# Altium schematic sheet 105358-3SC001-01-A_PWR_MGMT.SchDoc: Power Management
size 420 x 297 mm; DrawnBy: JeSa, KaKa; Organization: Hotswap Norden AB; Address1: Knarrarnäsgatan 7; Address2: SE-164 40 Kista; Address3: Sweden; DocumentNumber: 105358-3SC001-01; SheetNumber: 3; SheetTotal: 5; PageSetup: Record=PageOptions|CenterHorizontal=True|CenterVertical=True|PrintScale=0.96|XCorrection=1.00|YCorrection=1.00|PrintKind=0|BorderSize=5000000|LeftOffset=0|BottomOffset=0|Orientation=2|PaperLength=1000|PaperWidth=1000|Scale=100|PaperSource=7|PrintQuality=-4|MediaType=1|DitherType=10|PaperKind=A3|PrintScaleMode=1
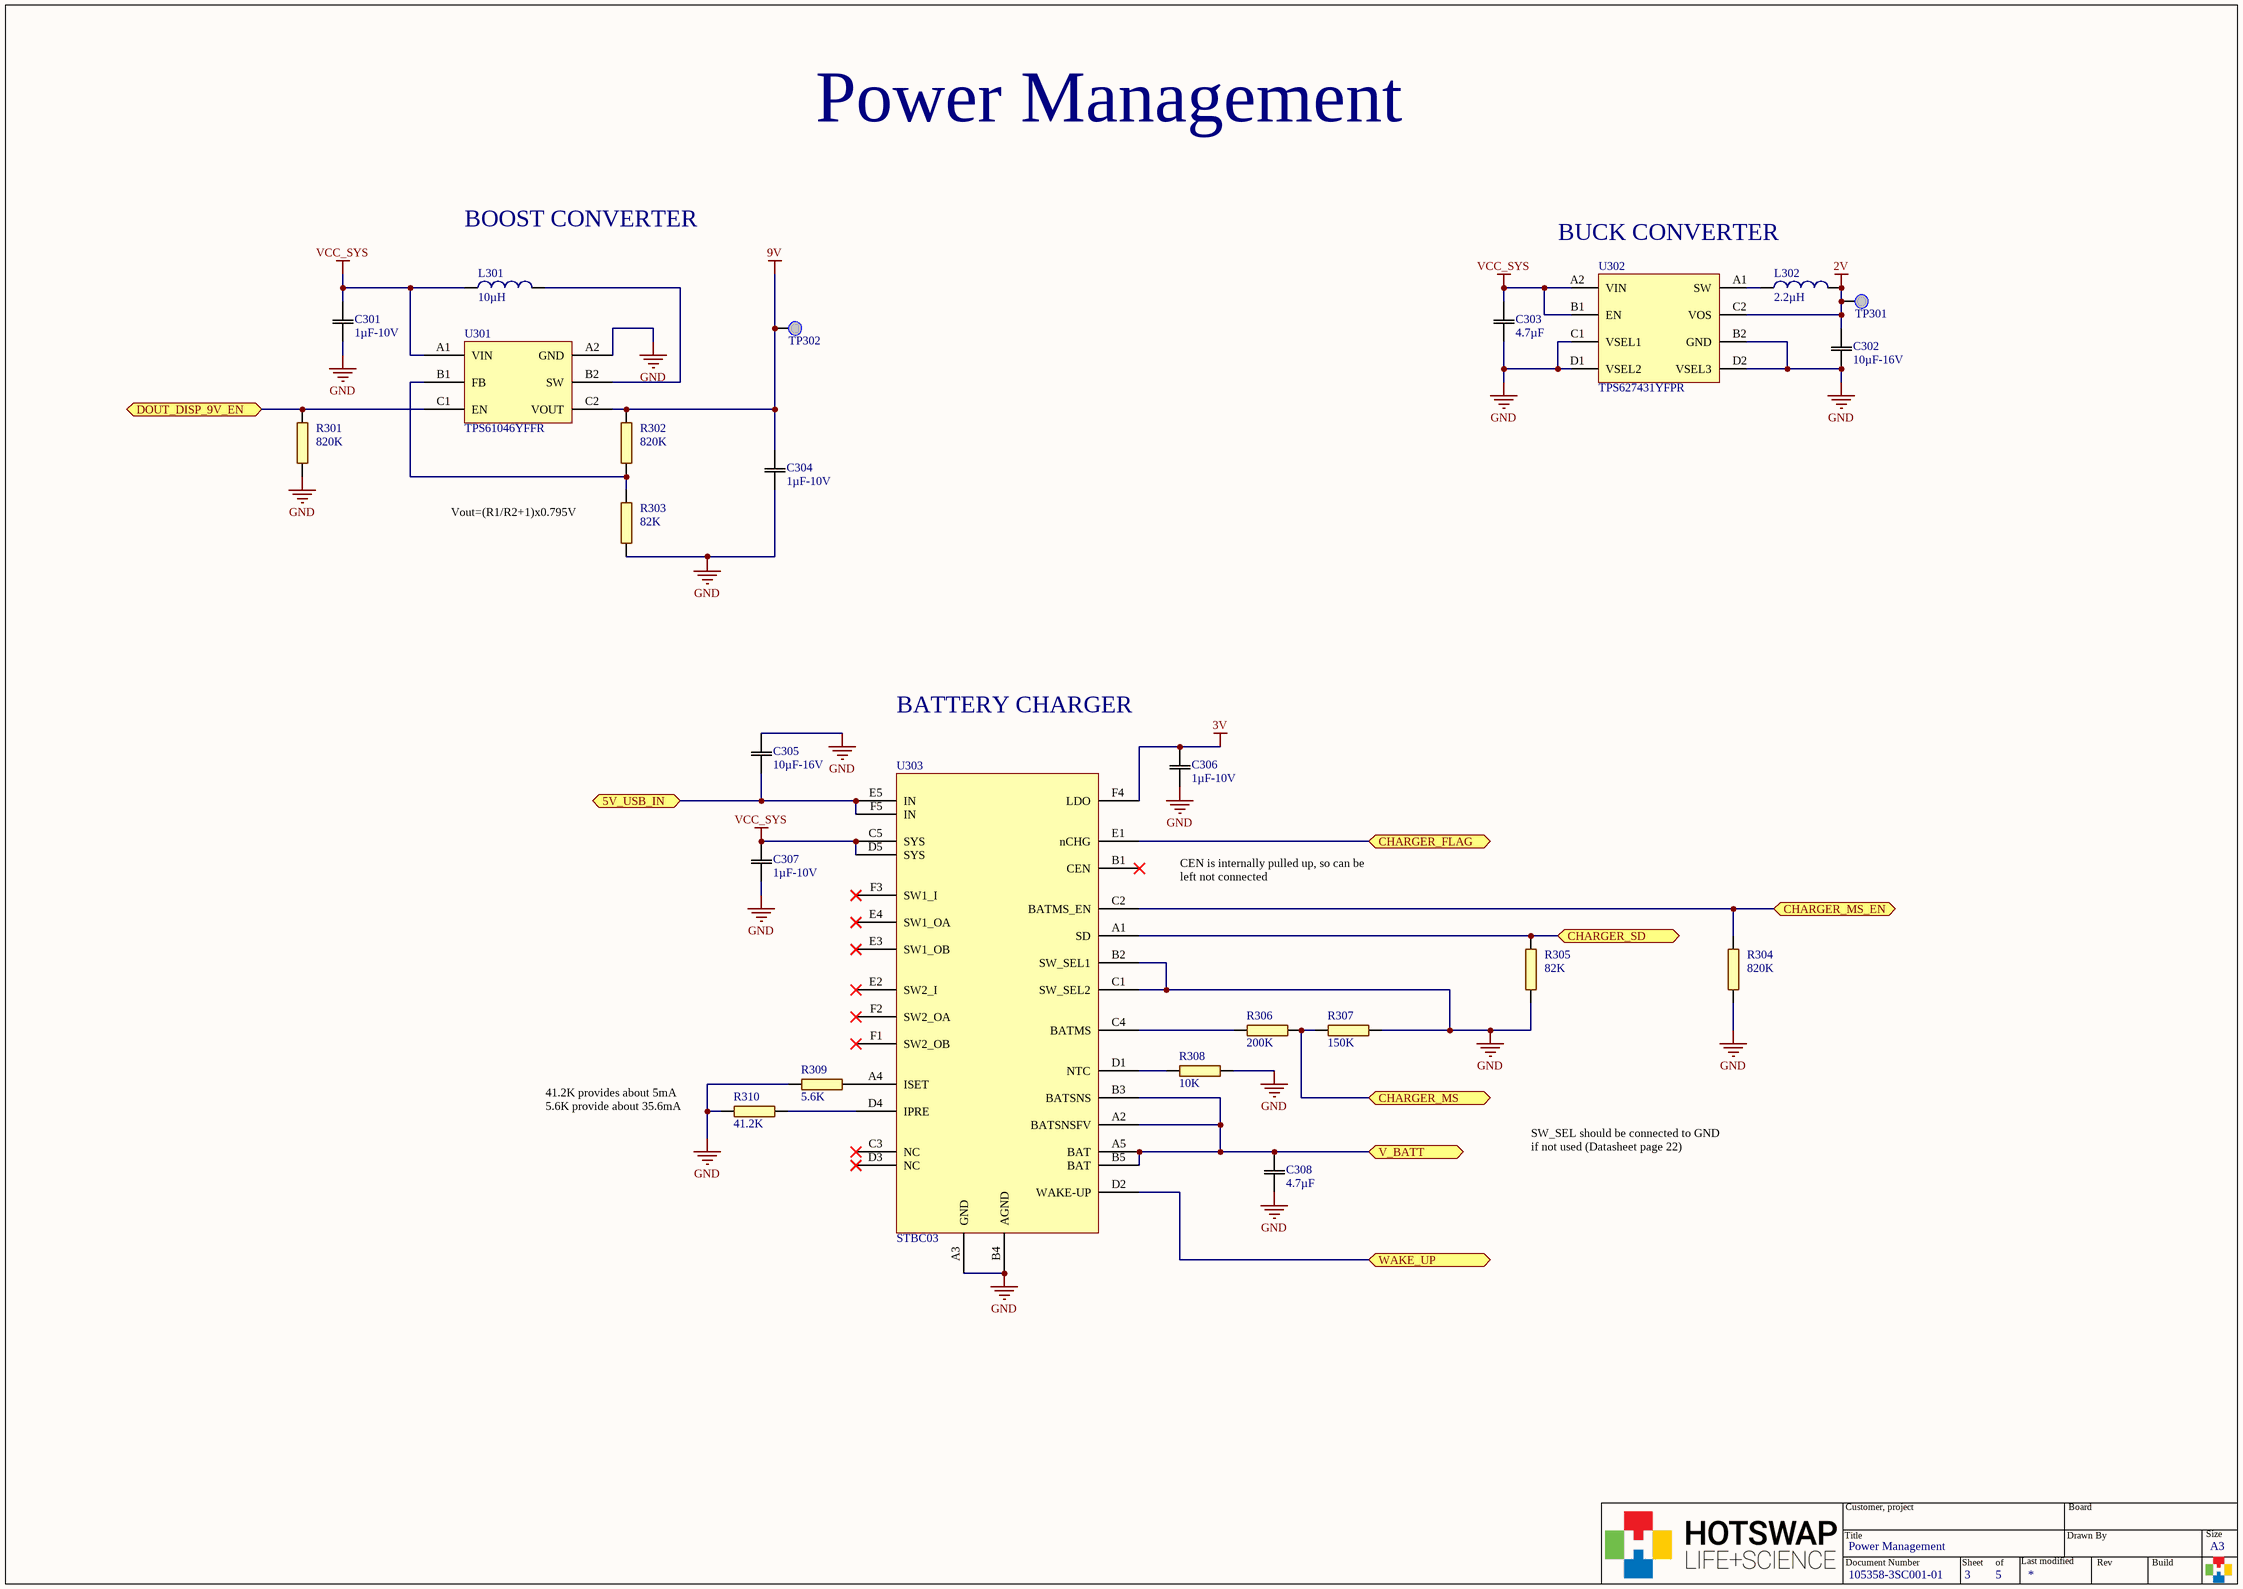
[diagram p0: 105358-3SC001-01-A_PWR_MGMT.SchDoc]

## Parts
C301  1µF-10V  [0402C_HIGH_DENSITY]
C302  10µF-16V  [0603C_HIGH_DENSITY]
C303  4.7µF  [0402C_HIGH_DENSITY]
C304  1µF-10V  [0402C_HIGH_DENSITY]
C305  10µF-16V  [0603C_HIGH_DENSITY]
C306  1µF-10V  [0402C_HIGH_DENSITY]
C307  1µF-10V  [0402C_HIGH_DENSITY]
C308  4.7µF  [0402C_HIGH_DENSITY]
L301  10µH  [0805L_HIGH_DENSITY]
L302  2.2µH  [0805L_HIGH_DENSITY]
R301  820K  [0402R-GENERIC]
R302  820K  [0402R-GENERIC]
R303  82K  [0402R-GENERIC]
R304  820K  [0402R-GENERIC]
R305  82K  [0402R-GENERIC]
R306  200K  [0402R-GENERIC]
R307  150K  [0402R-GENERIC]
R308  10K  [0402R-GENERIC]
R309  5.6K  [0402R-GENERIC]
R310  41.2K  [0402R-GENERIC]
TP301  TEST POINT  [PAD TEST POINT]  (value not drawn)  (no BOM)
TP302  TEST POINT  [PAD TEST POINT]  (value not drawn)  (no BOM)
U301  TPS61046YFFR  [TPS61046YFFR]
U302  TPS627431YFPR  [TPS627431YFPR]
U303  STBC03  [STBC03]

## Ports
5V_USB_IN, CHARGER_FLAG, CHARGER_MS, CHARGER_MS_EN, CHARGER_SD, DOUT_DISP_9V_EN, V_BATT, WAKE_UP

## Nets
2V: C302.2 L302.2 TP301.1(Test_Point) U302.C2(VOS)
3V: C306.2 U303.F4(LDO)
9V: C304.2 R302.1 TP302.1(Test_Point) U301.C2(VOUT)
GND: C301.1 C302.1 C303.1 C304.1 C305.2 C306.1 C307.1 C308.1 R301.2 R303.2 R304.2 R305.2 R307.2 R308.2 R309.1 R310.1 U301.A2(GND) U302.B2(GND) U302.C1(VSEL1) U302.D1(VSEL2) U302.D2(VSEL3) U303.A3(GND) U303.B2(SW_SEL1) U303.B4(AGND) U303.C1(SW_SEL2)
VCC_SYS: C301.2 C303.2 C307.2 L301.1 U301.A1(VIN) U302.A2(VIN) U302.B1(EN) U303.C5(SYS) U303.D5(SYS)
5V_USB_IN: C305.1 U303.E5(IN) U303.F5(IN) ; port 5V_USB_IN
CHARGER_FLAG: U303.E1(nCHG) ; port CHARGER_FLAG
CHARGER_MS: R306.2 R307.1 ; port CHARGER_MS
CHARGER_MS_EN: R304.1 U303.C2(BATMS_EN) ; port CHARGER_MS_EN
CHARGER_SD: R305.1 U303.A1(SD) ; port CHARGER_SD
DOUT_DISP_9V_EN: R301.1 U301.C1(EN) ; port DOUT_DISP_9V_EN
V_BATT: C308.2 U303.A2(BATSNSFV) U303.A5(BAT) U303.B3(BATSNS) U303.B5(BAT) ; port V_BATT
WAKE_UP: U303.D2(WAKE-UP) ; port WAKE_UP
NetL301_2: L301.2 U301.B2(SW)
NetL302_1: L302.1 U302.A1(SW)
NetR302_2: R302.2 R303.1 U301.B1(FB)
NetR306_1: R306.1 U303.C4(BATMS)
NetR308_1: R308.1 U303.D1(NTC)
NetR309_2: R309.2 U303.A4(ISET)
NetR310_2: R310.2 U303.D4(IPRE)

Not connected (* = marked no-connect by the designer): U303 B1(CEN)* C3(NC)* D3(NC)* E2(SW2_I)* E3(SW1_OB)* E4(SW1_OA)* F1(SW2_OB)* F2(SW2_OA)* F3(SW1_I)*

## Notes on the sheet
- Power Management
- BOOST CONVERTER
- BUCK CONVERTER
- (near R303) Vout=(R1/R2+1)x0.795V
- BATTERY CHARGER
- CEN is internally pulled up, so can be left not connected
- (near R310) 41.2K provides about 5mA
  5.6K provide about 35.6mA
- SW_SEL should be connected to GND
  if not used (Datasheet page 22)
- Title
- Customer, project
- Drawn By
- Board
- Size
- Document Number
- Sheet
- of
- Last modified
- Rev
- Build
- A3

## Library data of the parts
C301 C304 C306 C307 = 0402C-1uF-10V: 1µF ±10% 10V X5R Ceramic Capacitor 0402; Manufacturer Part Number: CC0402KRX5R6BB105; Manufacturer: Yageo; Capacitance: 1µF; Digi-Key Part Number: 311-1439-1-ND; PackageReference: 0402; Temperature Coefficient: X5R; Tolerance: 10%; Voltage - Rated: 10V
C302 C305 = 0603C-10uF-16V: 16µF ±10% 16V X5R Ceramic Capacitor 0603; Manufacturer Part Number: GRT188R61C106KE13D; Manufacturer: Murata Electronics North America; Capacitance: 10µF; Digi-Key Part Number: 490-12317-1-ND; PackageReference: 0603; Temperature Coefficient: X5R; Tolerance: 10%; Voltage - Rated: 16V
C303 C308 = 0402C-4.7uF-6.3V: 4.7µF ±10% 6.3V X5R Ceramic Capacitor 0402; Manufacturer Part Number: C1005X5R0J475K050BC; Manufacturer: TDK Corporation; Capacitance: 4.7µF; Digi-Key Part Number: 445-5947-1-ND; PackageReference: 0402; Temperature Coefficient: X5R; Tolerance: 10%; Voltage - Rated: 6.3V
L301 = 0805L-10uH-0.39Ohm: FIXED IND 10UH 500MA 300 MOHM; Manufacturer: TDK Corporation; Manufacturer Part Number: MLZ2012N100LT000; Number of Lines: 1; Current Rating (Max): 350mA; Tolerance: 20%; DCRDC Resistance (DCR): 390 mOhm Max; Digi-Key Part Number: 445-6762-1-ND; Impedance: 10µH; ComponentLink1Description: Datasheet; ComponentLink1URL: https://product.tdk.com/info/en/catalog/datasheets/inductor_commercial_decoupling_mlz2012_en.pdf; PackageReference: 0805
L302 = 0805L-2.2uH-0.2Ohm: FIXED IND 2.2UH 600MA 0.2OHM SMD; Manufacturer: TDK Corporation; Manufacturer Part Number: MLZ2012M2R2HTD25; Number of Lines: 1; Tolerance: 20%; Digi-Key Part Number: 445-17077-1-ND; Impedance: 2.2µH; Current Rating (Max): 600mA; ComponentLink1Description: Datasheet; ComponentLink1URL: https://www.digikey.com/product-detail/en/tdk-corporation/MLZ2012M2R2HTD25/445-17077-2-ND/4743205; PackageReference: 0805
R301 R302 R304 = 0402R-820k OHM-1%-0.063W: RES SMD 820kOHM 1% 1/16W 0402; Manufacturer: Yageo; Manufacturer Part Number: RC0402FR-07820KL; Power: 0.063W; GENERIC_OK: YES; Digi-Key Part Number: YAG3240CT-ND; Resistance (Ohms): 820KOhm; Tolerance: 1%; PackageReference: 0402
R303 R305 = 0402R-82k OHM-1%-0.063W: RES SMD 82kOHM 1% 1/16W 0402; Manufacturer: Yageo; Manufacturer Part Number: RC0402FR-0782KL; Power: 0.063W; GENERIC_OK: YES; Digi-Key Part Number: 311-82.0KLRCT-ND; Resistance (Ohms): 82KOhm; Tolerance: 1%; PackageReference: 0402
R306 = 0402R-200k OHM-1%-0.063W: RES SMD 200kOHM 1% 1/16W 0402; Manufacturer: Yageo; Manufacturer Part Number: AC0402FR-07200KL; Power: 0.063W; GENERIC_OK: YES; Digi-Key Part Number: YAG3452CT-ND; Resistance (Ohms): 200KOhm; Tolerance: 1%; PackageReference: 0402; Features: Moisture Resistant
R307 = 0402R-150k OHM-5%-0.063W: RES SMD 150kOHM 5% 1/16W 0402; Manufacturer: Yageo; Manufacturer Part Number: RC0402JR-07150KL; Power: 0.063W; GENERIC_OK: YES; Digi-Key Part Number: 311-150KJRCT-ND; Resistance (Ohms): 150KOhm; Tolerance: 5%; PackageReference: 0402; Features: Moisture Resistant
R308 = 0402R-10k OHM-1%-0.063W: RES SMD 10kOHM 1% 1/16W 0402; Manufacturer: Yageo; Manufacturer Part Number: RC0402FR-0710KL; Power: 0.063W; GENERIC_OK: YES; Digi-Key Part Number: 311-10.0KLRCT-ND; Resistance (Ohms): 10KOhm; Tolerance: 1%; PackageReference: 0402; Features: Moisture Resistant
R309 = 0402R-5.6k OHM-5%-0.063W: RES SMD 5.6kOHM 5% 1/16W 0402; Manufacturer: Yageo; Manufacturer Part Number: RC0402JR-075K6L; Power: 0.063W; GENERIC_OK: YES; Digi-Key Part Number: 311-5.6KJRCT-ND; Resistance (Ohms): 5.6KOhm; Tolerance: 5%; PackageReference: 0402
R310 = 0402R-41.2k OHM-1%-0.063W: RES SMD 41.2kOHM 1% 1/16W 0402; Manufacturer: Yageo; Manufacturer Part Number: RC0402FR-0741K2L; Power: 0.063W; GENERIC_OK: YES; Digi-Key Part Number: YAG3155CT-ND; Resistance (Ohms): 41.2KOhm; Tolerance: 1%; PackageReference: 0402
TP301 TP302 = TEST POINT: Testing Poiny
U301 = TPS61046YFFR: Boost converter 28V; Manufacturer: Texas Instruments; Voltage - Supply (Min): 1.8V; Voltage - Supply (Max): 5.5V; Voltage - Output: 4.5 V ~ 28 V; Current - Output / Channe: 1.2A (Switch); Frequency: 1.05MHz; Supplier 1: Digi-Key; Supplier Part Number 1: 296-44337-1-ND; ComponentLink1URL: http://www.ti.com/lit/ds/symlink/tps61046.pdf; ComponentLink1Description: Datasheet; Manufacturer Part Number: TPS61046YFFR; PackageReference: 6-UFBGA, DSBGA; Digi-Key Part Number: 296-44337-1-ND
U302 = TPS627431YFPR: Buck Converter; Manufacturer: Texas Instruments; Output Configuration: Positive; Function: Step-Down; Voltage - Input (Min): 2.15V; Voltage - Input (Max): 5.5V; Voltage - Output (Min/Fixed): 1.3V; Voltage - Output (Max): 3.1V; Current - Output: 400mA; Frequency - Switching: 1.2MHz; Synchronous Rectifier: Yes; ComponentLink1URL: http://www.ti.com/lit/ds/symlink/tps62743.pdf; ComponentLink1Description: Datasheet; Manufacturer Part Number: TPS627431YFPR; PackageReference: 8-XFBGA, DSBGA; Digi-Key Part Number: 296-44499-2-ND
U303 = STBC03: Li-Ion linear battery charger; Manufacturer Part Number: STBC03JR; Manufacturer: STMicroelectronics; Battery Chemistry: Lithium-Ion/Polymer; Battery Pack Voltag: 4.2V; Voltage - Supply (Max): 5.4V; Charge Current - Max: 650mA; ComponentLink1URL: http://www.st.com/content/ccc/resource/technical/document/datasheet/group3/05/ea/e8/4e/a7/a6/4a/c6/DM00338132/files/DM00338132.pdf/jcr:content/translations/en.DM00338132.pdf; ComponentLink1Description: Datasheet; PackageReference: 30-UFBGA, FCBGA; Digi-Key Part Number: 497-17241-1-ND